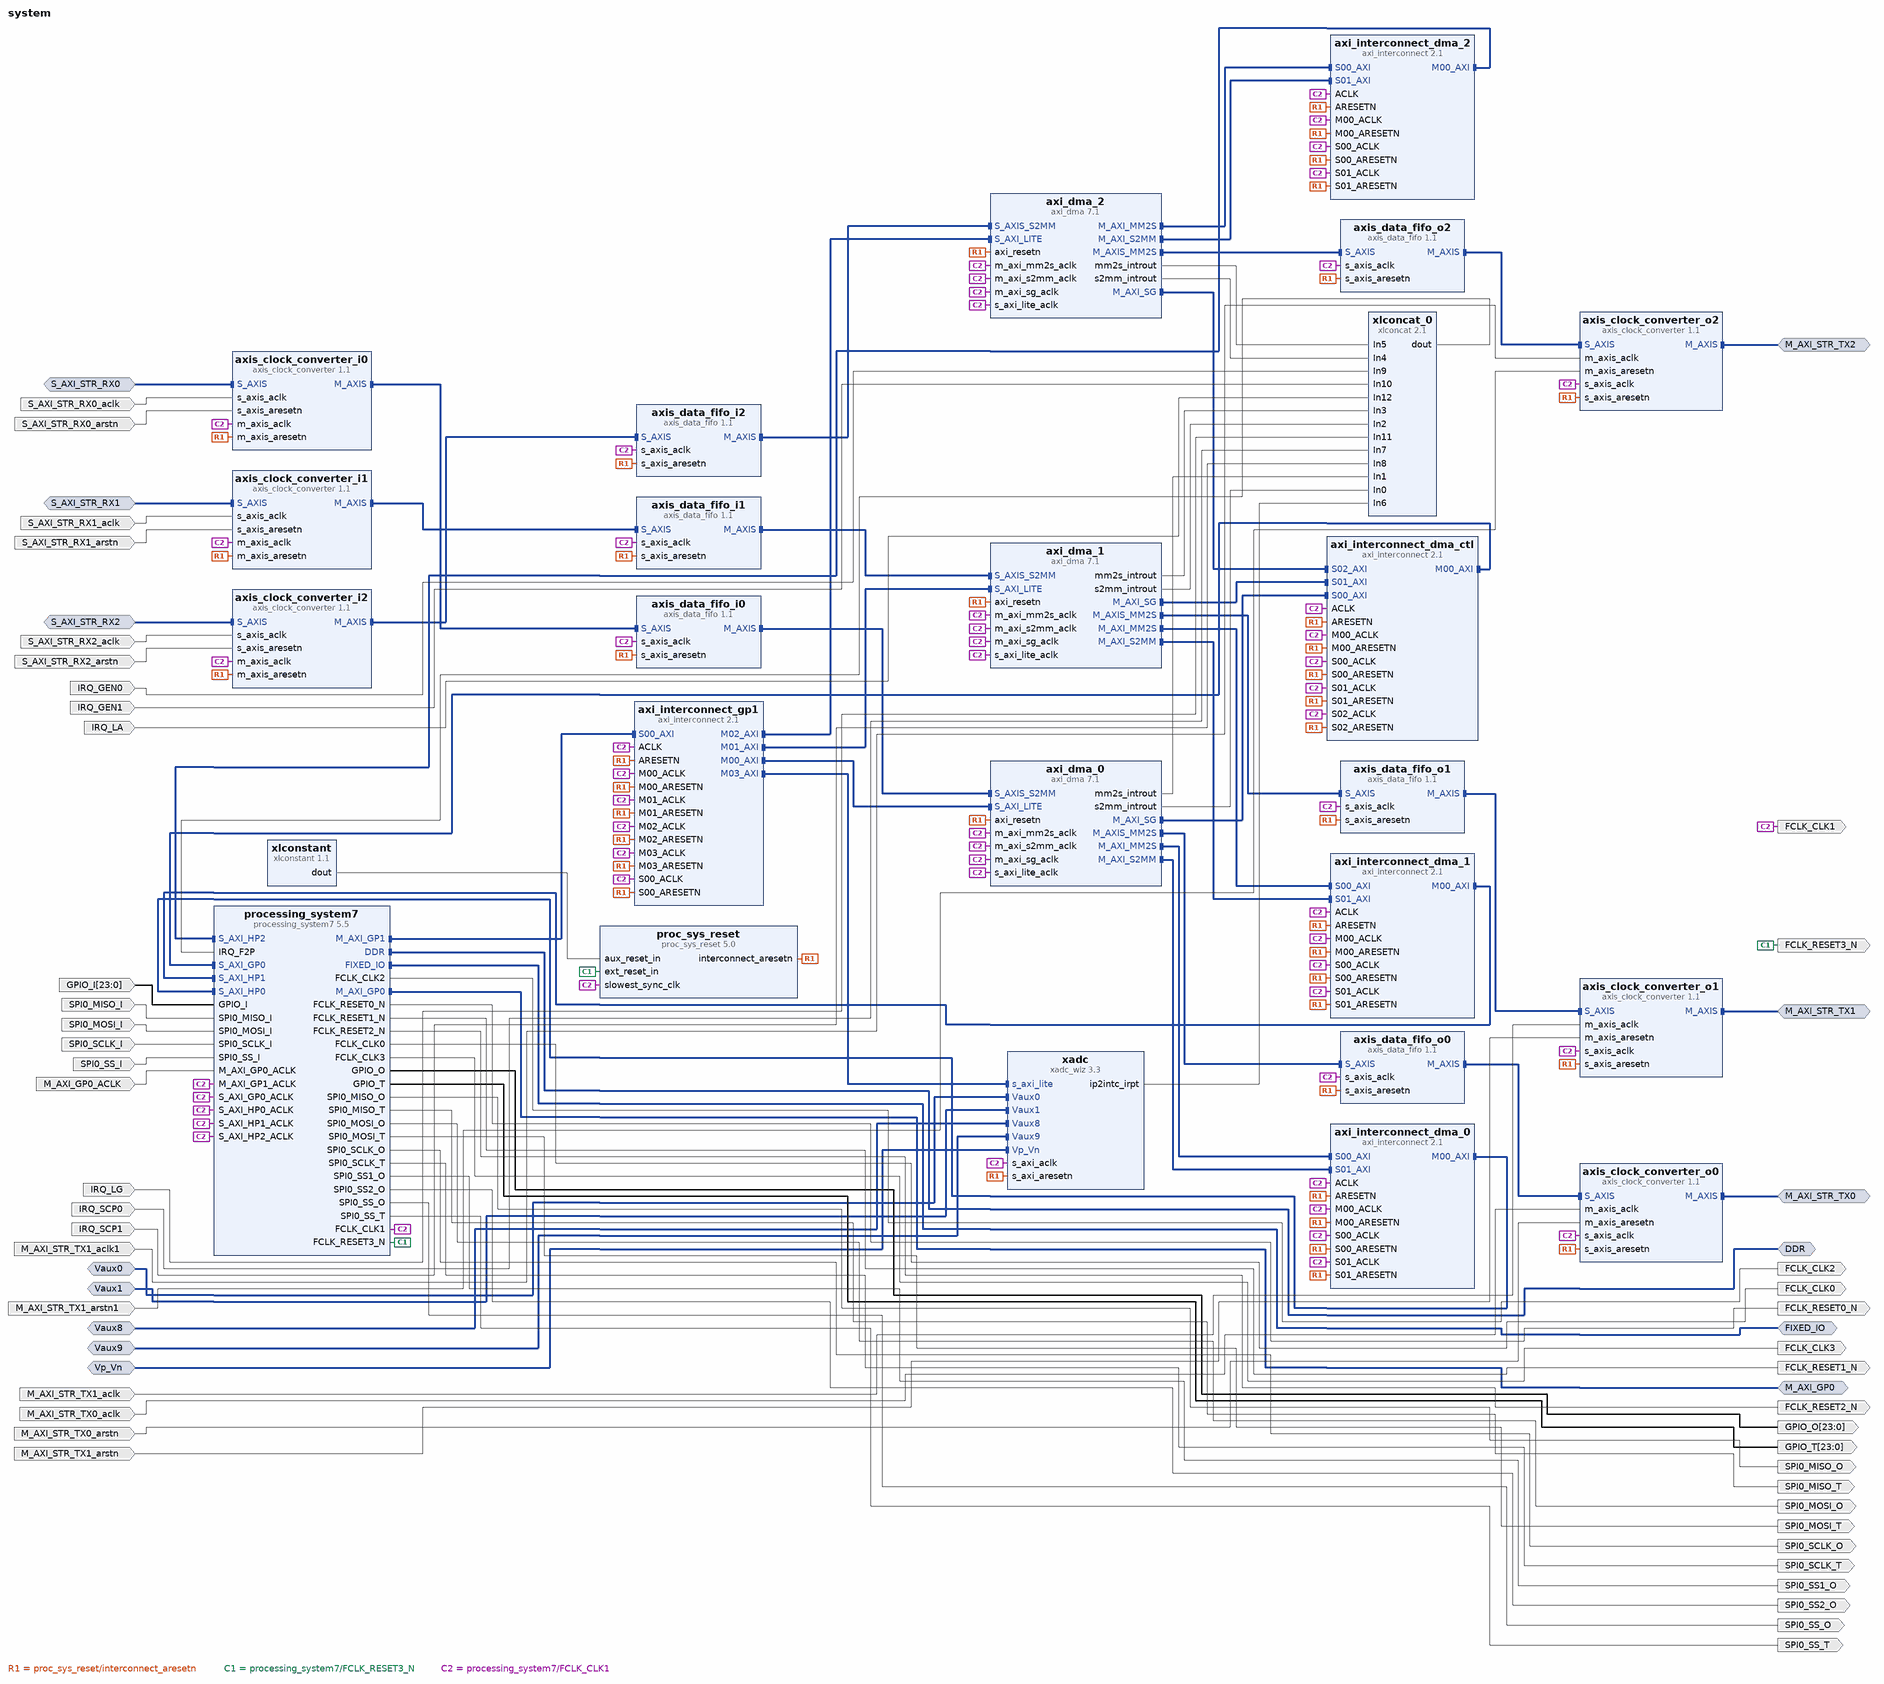
[diagram p0: block diagram of the top level]
# Vivado block design system, xc7z010clg400-1, Vivado 2016.4
create_bd_design system

create_bd_intf_port -mode Master -vlnv xilinx.com:interface:ddrx_rtl:1.0 DDR
create_bd_intf_port -mode Master -vlnv xilinx.com:display_processing_system7:fixedio_rtl:1.0 FIXED_IO
create_bd_intf_port -mode Master -vlnv xilinx.com:interface:aximm_rtl:1.0 M_AXI_GP0
set_property -dict [list \
  CONFIG.DATA_WIDTH 32 \
  CONFIG.PROTOCOL AXI3 \
  CONFIG.FREQ_HZ 125000000 \
  CONFIG.ADDR_WIDTH 32 \
] [get_bd_intf_ports M_AXI_GP0]
create_bd_intf_port -mode Master -vlnv xilinx.com:interface:axis_rtl:1.0 M_AXI_STR_TX0
set_property -dict {CONFIG.FREQ_HZ 125000000} [get_bd_intf_ports M_AXI_STR_TX0]
create_bd_intf_port -mode Master -vlnv xilinx.com:interface:axis_rtl:1.0 M_AXI_STR_TX1
set_property -dict {CONFIG.FREQ_HZ 125000000} [get_bd_intf_ports M_AXI_STR_TX1]
create_bd_intf_port -mode Master -vlnv xilinx.com:interface:axis_rtl:1.0 M_AXI_STR_TX2
set_property -dict {CONFIG.FREQ_HZ 125000000} [get_bd_intf_ports M_AXI_STR_TX2]
create_bd_intf_port -mode Slave -vlnv xilinx.com:interface:axis_rtl:1.0 S_AXI_STR_RX0
set_property -dict [list \
  CONFIG.TDATA_NUM_BYTES 2 \
  CONFIG.TDEST_WIDTH 0 \
  CONFIG.TID_WIDTH 0 \
  CONFIG.TUSER_WIDTH 0 \
  CONFIG.HAS_TREADY 1 \
  CONFIG.HAS_TSTRB 0 \
  CONFIG.HAS_TKEEP 1 \
  CONFIG.HAS_TLAST 1 \
  CONFIG.FREQ_HZ 125000000 \
  CONFIG.LAYERED_METADATA undef \
] [get_bd_intf_ports S_AXI_STR_RX0]
create_bd_intf_port -mode Slave -vlnv xilinx.com:interface:axis_rtl:1.0 S_AXI_STR_RX1
set_property -dict [list \
  CONFIG.TDATA_NUM_BYTES 2 \
  CONFIG.TDEST_WIDTH 0 \
  CONFIG.TID_WIDTH 0 \
  CONFIG.TUSER_WIDTH 0 \
  CONFIG.HAS_TREADY 1 \
  CONFIG.HAS_TSTRB 0 \
  CONFIG.HAS_TKEEP 1 \
  CONFIG.HAS_TLAST 1 \
  CONFIG.FREQ_HZ 125000000 \
  CONFIG.LAYERED_METADATA undef \
] [get_bd_intf_ports S_AXI_STR_RX1]
create_bd_intf_port -mode Slave -vlnv xilinx.com:interface:axis_rtl:1.0 S_AXI_STR_RX2
set_property -dict [list \
  CONFIG.TDATA_NUM_BYTES 2 \
  CONFIG.TDEST_WIDTH 0 \
  CONFIG.TID_WIDTH 0 \
  CONFIG.TUSER_WIDTH 0 \
  CONFIG.HAS_TREADY 1 \
  CONFIG.HAS_TSTRB 0 \
  CONFIG.HAS_TKEEP 1 \
  CONFIG.HAS_TLAST 1 \
  CONFIG.FREQ_HZ 125000000 \
  CONFIG.LAYERED_METADATA undef \
] [get_bd_intf_ports S_AXI_STR_RX2]
create_bd_intf_port -mode Slave -vlnv xilinx.com:interface:diff_analog_io_rtl:1.0 Vaux0
create_bd_intf_port -mode Slave -vlnv xilinx.com:interface:diff_analog_io_rtl:1.0 Vaux1
create_bd_intf_port -mode Slave -vlnv xilinx.com:interface:diff_analog_io_rtl:1.0 Vaux8
create_bd_intf_port -mode Slave -vlnv xilinx.com:interface:diff_analog_io_rtl:1.0 Vaux9
create_bd_intf_port -mode Slave -vlnv xilinx.com:interface:diff_analog_io_rtl:1.0 Vp_Vn
create_bd_port -dir O -type clk FCLK_CLK0
create_bd_port -dir O -type clk FCLK_CLK1
set_property -dict {CONFIG.ASSOCIATED_BUSIF M_AXI_STR_TX3:S_AXI_STR_RX3} [get_bd_ports FCLK_CLK1]
create_bd_port -dir O -type clk FCLK_CLK2
create_bd_port -dir O -type clk FCLK_CLK3
create_bd_port -dir O -type rst FCLK_RESET0_N
create_bd_port -dir O -type rst FCLK_RESET1_N
create_bd_port -dir O -type rst FCLK_RESET2_N
create_bd_port -dir O -type rst FCLK_RESET3_N
create_bd_port -dir I -from 23 -to 0 -type data GPIO_I
create_bd_port -dir O -from 23 -to 0 -type data GPIO_O
create_bd_port -dir O -from 23 -to 0 -type data GPIO_T
create_bd_port -dir I -type intr IRQ_GEN0
set_property -dict {CONFIG.SENSITIVITY EDGE_RISING} [get_bd_ports IRQ_GEN0]
create_bd_port -dir I -type intr IRQ_GEN1
set_property -dict {CONFIG.SENSITIVITY EDGE_RISING} [get_bd_ports IRQ_GEN1]
create_bd_port -dir I -type intr IRQ_LA
set_property -dict {CONFIG.SENSITIVITY EDGE_RISING} [get_bd_ports IRQ_LA]
create_bd_port -dir I -type intr IRQ_LG
set_property -dict {CONFIG.SENSITIVITY EDGE_RISING} [get_bd_ports IRQ_LG]
create_bd_port -dir I -type intr IRQ_SCP0
set_property -dict {CONFIG.SENSITIVITY EDGE_RISING} [get_bd_ports IRQ_SCP0]
create_bd_port -dir I -type intr IRQ_SCP1
set_property -dict {CONFIG.SENSITIVITY EDGE_RISING} [get_bd_ports IRQ_SCP1]
create_bd_port -dir I -type clk M_AXI_GP0_ACLK
set_property -dict {CONFIG.FREQ_HZ 125000000 CONFIG.ASSOCIATED_BUSIF M_AXI_GP0} [get_bd_ports M_AXI_GP0_ACLK]
create_bd_port -dir I -type clk M_AXI_STR_TX0_aclk
set_property -dict [list \
  CONFIG.FREQ_HZ 125000000 \
  CONFIG.ASSOCIATED_BUSIF M_AXI_STR_TX0 \
  CONFIG.ASSOCIATED_RESET M_AXI_STR_TX0_arstn \
] [get_bd_ports M_AXI_STR_TX0_aclk]
create_bd_port -dir I -type rst M_AXI_STR_TX0_arstn
create_bd_port -dir I -type clk M_AXI_STR_TX1_aclk
set_property -dict [list \
  CONFIG.FREQ_HZ 125000000 \
  CONFIG.ASSOCIATED_BUSIF M_AXI_STR_TX1 \
  CONFIG.ASSOCIATED_RESET M_AXI_STR_TX1_arstn \
] [get_bd_ports M_AXI_STR_TX1_aclk]
create_bd_port -dir I -type clk M_AXI_STR_TX1_aclk1
set_property -dict [list \
  CONFIG.FREQ_HZ 125000000 \
  CONFIG.ASSOCIATED_BUSIF M_AXI_STR_TX1:M_AXI_STR_TX2 \
  CONFIG.ASSOCIATED_RESET M_AXI_STR_TX1_arstn:M_AXI_STR_TX1_arstn1 \
] [get_bd_ports M_AXI_STR_TX1_aclk1]
create_bd_port -dir I -type rst M_AXI_STR_TX1_arstn
create_bd_port -dir I -type rst M_AXI_STR_TX1_arstn1
create_bd_port -dir I SPI0_MISO_I
create_bd_port -dir O SPI0_MISO_O
create_bd_port -dir O SPI0_MISO_T
create_bd_port -dir I SPI0_MOSI_I
create_bd_port -dir O SPI0_MOSI_O
create_bd_port -dir O SPI0_MOSI_T
create_bd_port -dir I SPI0_SCLK_I
create_bd_port -dir O SPI0_SCLK_O
create_bd_port -dir O SPI0_SCLK_T
create_bd_port -dir O SPI0_SS1_O
create_bd_port -dir O SPI0_SS2_O
create_bd_port -dir I SPI0_SS_I
create_bd_port -dir O SPI0_SS_O
create_bd_port -dir O SPI0_SS_T
create_bd_port -dir I -type clk S_AXI_STR_RX0_aclk
set_property -dict [list \
  CONFIG.FREQ_HZ 125000000 \
  CONFIG.ASSOCIATED_BUSIF S_AXI_STR_RX0 \
  CONFIG.ASSOCIATED_RESET S_AXI_STR_RX0_arstn \
] [get_bd_ports S_AXI_STR_RX0_aclk]
create_bd_port -dir I -type rst S_AXI_STR_RX0_arstn
create_bd_port -dir I -type clk S_AXI_STR_RX1_aclk
set_property -dict [list \
  CONFIG.FREQ_HZ 125000000 \
  CONFIG.ASSOCIATED_BUSIF S_AXI_STR_RX1 \
  CONFIG.ASSOCIATED_RESET S_AXI_STR_RX1_arstn \
] [get_bd_ports S_AXI_STR_RX1_aclk]
create_bd_port -dir I -type rst S_AXI_STR_RX1_arstn
create_bd_port -dir I -type clk S_AXI_STR_RX2_aclk
set_property -dict [list \
  CONFIG.FREQ_HZ 125000000 \
  CONFIG.ASSOCIATED_BUSIF S_AXI_STR_RX1:S_AXI_STR_RX2 \
  CONFIG.ASSOCIATED_RESET S_AXI_STR_RX1_arstn:S_AXI_STR_RX2_arstn \
] [get_bd_ports S_AXI_STR_RX2_aclk]
create_bd_port -dir I -type rst S_AXI_STR_RX2_arstn

create_bd_cell -type ip -vlnv xilinx.com:ip:axi_dma:7.1 axi_dma_0
set_property -dict [list \
  CONFIG.c_include_sg 1 \
  CONFIG.c_sg_length_width 14 \
  CONFIG.c_sg_include_stscntrl_strm 0 \
  CONFIG.c_micro_dma 0 \
  CONFIG.c_include_mm2s 1 \
  CONFIG.c_m_axi_mm2s_data_width 32 \
  CONFIG.c_m_axis_mm2s_tdata_width 16 \
  CONFIG.c_mm2s_burst_size 16 \
  CONFIG.c_s2mm_burst_size 64 \
] [get_bd_cells axi_dma_0]
create_bd_cell -type ip -vlnv xilinx.com:ip:axi_dma:7.1 axi_dma_1
set_property -dict [list \
  CONFIG.c_include_sg 1 \
  CONFIG.c_sg_length_width 23 \
  CONFIG.c_sg_include_stscntrl_strm 0 \
  CONFIG.c_include_mm2s 1 \
  CONFIG.c_m_axi_mm2s_data_width 32 \
  CONFIG.c_m_axis_mm2s_tdata_width 16 \
  CONFIG.c_mm2s_burst_size 64 \
  CONFIG.c_s2mm_burst_size 64 \
] [get_bd_cells axi_dma_1]
create_bd_cell -type ip -vlnv xilinx.com:ip:axi_dma:7.1 axi_dma_2
set_property -dict [list \
  CONFIG.c_include_sg 1 \
  CONFIG.c_sg_length_width 23 \
  CONFIG.c_sg_include_stscntrl_strm 0 \
  CONFIG.c_include_mm2s 1 \
  CONFIG.c_m_axi_mm2s_data_width 32 \
  CONFIG.c_m_axis_mm2s_tdata_width 16 \
  CONFIG.c_mm2s_burst_size 64 \
  CONFIG.c_s2mm_burst_size 64 \
] [get_bd_cells axi_dma_2]
create_bd_cell -type ip -vlnv xilinx.com:ip:axi_interconnect:2.1 axi_interconnect_dma_0
set_property -dict {CONFIG.NUM_SI 2 CONFIG.NUM_MI 1 CONFIG.STRATEGY 1} [get_bd_cells axi_interconnect_dma_0]
create_bd_cell -type ip -vlnv xilinx.com:ip:axi_interconnect:2.1 axi_interconnect_dma_1
set_property -dict {CONFIG.NUM_SI 2 CONFIG.NUM_MI 1 CONFIG.STRATEGY 1} [get_bd_cells axi_interconnect_dma_1]
create_bd_cell -type ip -vlnv xilinx.com:ip:axi_interconnect:2.1 axi_interconnect_dma_2
set_property -dict {CONFIG.NUM_SI 2 CONFIG.NUM_MI 1 CONFIG.STRATEGY 1} [get_bd_cells axi_interconnect_dma_2]
create_bd_cell -type ip -vlnv xilinx.com:ip:axi_interconnect:2.1 axi_interconnect_dma_ctl
set_property -dict {CONFIG.NUM_SI 3 CONFIG.NUM_MI 1 CONFIG.STRATEGY 1} [get_bd_cells axi_interconnect_dma_ctl]
create_bd_cell -type ip -vlnv xilinx.com:ip:axi_interconnect:2.1 axi_interconnect_gp1
set_property -dict {CONFIG.NUM_SI 1 CONFIG.NUM_MI 4 CONFIG.STRATEGY 1} [get_bd_cells axi_interconnect_gp1]
create_bd_cell -type ip -vlnv xilinx.com:ip:axis_clock_converter:1.1 axis_clock_converter_i0
create_bd_cell -type ip -vlnv xilinx.com:ip:axis_clock_converter:1.1 axis_clock_converter_i1
create_bd_cell -type ip -vlnv xilinx.com:ip:axis_clock_converter:1.1 axis_clock_converter_i2
create_bd_cell -type ip -vlnv xilinx.com:ip:axis_clock_converter:1.1 axis_clock_converter_o0
create_bd_cell -type ip -vlnv xilinx.com:ip:axis_clock_converter:1.1 axis_clock_converter_o1
create_bd_cell -type ip -vlnv xilinx.com:ip:axis_clock_converter:1.1 axis_clock_converter_o2
create_bd_cell -type ip -vlnv xilinx.com:ip:axis_data_fifo:1.1 axis_data_fifo_i0
set_property -dict {CONFIG.FIFO_DEPTH 2048 CONFIG.FIFO_MODE 2} [get_bd_cells axis_data_fifo_i0]
create_bd_cell -type ip -vlnv xilinx.com:ip:axis_data_fifo:1.1 axis_data_fifo_i1
set_property -dict {CONFIG.FIFO_DEPTH 2048 CONFIG.FIFO_MODE 2} [get_bd_cells axis_data_fifo_i1]
create_bd_cell -type ip -vlnv xilinx.com:ip:axis_data_fifo:1.1 axis_data_fifo_i2
set_property -dict {CONFIG.FIFO_DEPTH 2048 CONFIG.FIFO_MODE 2} [get_bd_cells axis_data_fifo_i2]
create_bd_cell -type ip -vlnv xilinx.com:ip:axis_data_fifo:1.1 axis_data_fifo_o0
set_property -dict {CONFIG.FIFO_DEPTH 2048 CONFIG.FIFO_MODE 2} [get_bd_cells axis_data_fifo_o0]
create_bd_cell -type ip -vlnv xilinx.com:ip:axis_data_fifo:1.1 axis_data_fifo_o1
set_property -dict {CONFIG.FIFO_DEPTH 2048 CONFIG.FIFO_MODE 2} [get_bd_cells axis_data_fifo_o1]
create_bd_cell -type ip -vlnv xilinx.com:ip:axis_data_fifo:1.1 axis_data_fifo_o2
set_property -dict {CONFIG.FIFO_DEPTH 2048 CONFIG.FIFO_MODE 2} [get_bd_cells axis_data_fifo_o2]
create_bd_cell -type ip -vlnv xilinx.com:ip:proc_sys_reset:5.0 proc_sys_reset
set_property -dict {CONFIG.C_EXT_RST_WIDTH 1} [get_bd_cells proc_sys_reset]
create_bd_cell -type ip -vlnv xilinx.com:ip:processing_system7:5.5 processing_system7
set_property -dict [list \
  CONFIG.PCW_QSPI_PERIPHERAL_FREQMHZ 125 \
  CONFIG.PCW_FPGA0_PERIPHERAL_FREQMHZ 125 \
  CONFIG.PCW_FPGA1_PERIPHERAL_FREQMHZ 142 \
  CONFIG.PCW_FPGA2_PERIPHERAL_FREQMHZ 166 \
  CONFIG.PCW_FPGA3_PERIPHERAL_FREQMHZ 200 \
  CONFIG.PCW_USE_M_AXI_GP1 1 \
  CONFIG.PCW_USE_S_AXI_GP0 1 \
  CONFIG.PCW_USE_S_AXI_HP0 1 \
  CONFIG.PCW_USE_S_AXI_HP1 1 \
  CONFIG.PCW_USE_S_AXI_HP2 1 \
  CONFIG.PCW_USE_FABRIC_INTERRUPT 1 \
  CONFIG.PCW_S_AXI_HP0_DATA_WIDTH 32 \
  CONFIG.PCW_S_AXI_HP1_DATA_WIDTH 32 \
  CONFIG.PCW_S_AXI_HP2_DATA_WIDTH 32 \
  CONFIG.PCW_EN_CLK1_PORT 1 \
  CONFIG.PCW_EN_CLK2_PORT 1 \
  CONFIG.PCW_EN_CLK3_PORT 1 \
  CONFIG.PCW_EN_RST1_PORT 1 \
  CONFIG.PCW_EN_RST2_PORT 1 \
  CONFIG.PCW_EN_RST3_PORT 1 \
  CONFIG.PCW_IRQ_F2P_INTR 1 \
  CONFIG.PCW_PRESET_BANK1_VOLTAGE {LVCMOS 2.5V} \
  CONFIG.PCW_UIPARAM_DDR_BUS_WIDTH {16 Bit} \
  CONFIG.PCW_UIPARAM_DDR_PARTNO {MT41J256M16 RE-125} \
  CONFIG.PCW_QSPI_PERIPHERAL_ENABLE 1 \
  CONFIG.PCW_QSPI_GRP_SINGLE_SS_ENABLE 1 \
  CONFIG.PCW_ENET0_PERIPHERAL_ENABLE 1 \
  CONFIG.PCW_ENET0_ENET0_IO {MIO 16 .. 27} \
  CONFIG.PCW_ENET0_GRP_MDIO_ENABLE 1 \
  CONFIG.PCW_ENET0_RESET_ENABLE 0 \
  CONFIG.PCW_SD0_PERIPHERAL_ENABLE 1 \
  CONFIG.PCW_SD0_GRP_CD_ENABLE 1 \
  CONFIG.PCW_SD0_GRP_CD_IO {MIO 46} \
  CONFIG.PCW_SD0_GRP_WP_ENABLE 1 \
  CONFIG.PCW_SD0_GRP_WP_IO {MIO 47} \
  CONFIG.PCW_UART0_PERIPHERAL_ENABLE 1 \
  CONFIG.PCW_UART0_UART0_IO {MIO 14 .. 15} \
  CONFIG.PCW_UART1_PERIPHERAL_ENABLE 1 \
  CONFIG.PCW_UART1_UART1_IO {MIO 8 .. 9} \
  CONFIG.PCW_SPI0_PERIPHERAL_ENABLE 1 \
  CONFIG.PCW_SPI1_PERIPHERAL_ENABLE 1 \
  CONFIG.PCW_SPI1_SPI1_IO {MIO 10 .. 15} \
  CONFIG.PCW_TTC0_PERIPHERAL_ENABLE 1 \
  CONFIG.PCW_USB0_PERIPHERAL_ENABLE 1 \
  CONFIG.PCW_USB0_RESET_ENABLE 1 \
  CONFIG.PCW_USB0_RESET_IO {MIO 48} \
  CONFIG.PCW_I2C0_PERIPHERAL_ENABLE 1 \
  CONFIG.PCW_I2C0_I2C0_IO {MIO 50 .. 51} \
  CONFIG.PCW_GPIO_MIO_GPIO_ENABLE 1 \
  CONFIG.PCW_GPIO_EMIO_GPIO_ENABLE 1 \
  CONFIG.PCW_GPIO_EMIO_GPIO_IO 24 \
] [get_bd_cells processing_system7]
# 57 more settings of processing_system7 are not shown: defaults, MIO pin electricals, DDR timing, and values the tool derives
create_bd_cell -type ip -vlnv xilinx.com:ip:xadc_wiz:3.3 xadc
set_property -dict [list \
  CONFIG.XADC_STARUP_SELECTION independent_adc \
  CONFIG.SEQUENCER_MODE Off \
  CONFIG.SINGLE_CHANNEL_SELECTION TEMPERATURE \
  CONFIG.EXTERNAL_MUX_CHANNEL VP_VN \
  CONFIG.CHANNEL_ENABLE_VP_VN true \
  CONFIG.CHANNEL_ENABLE_VAUXP0_VAUXN0 true \
  CONFIG.CHANNEL_ENABLE_VAUXP1_VAUXN1 true \
  CONFIG.CHANNEL_ENABLE_VAUXP8_VAUXN8 true \
  CONFIG.CHANNEL_ENABLE_VAUXP9_VAUXN9 true \
] [get_bd_cells xadc]
create_bd_cell -type ip -vlnv xilinx.com:ip:xlconcat:2.1 xlconcat_0
set_property -dict {CONFIG.NUM_PORTS 13} [get_bd_cells xlconcat_0]
create_bd_cell -type ip -vlnv xilinx.com:ip:xlconstant:1.1 xlconstant

# ---- connections ----

connect_bd_intf_net [get_bd_intf_pins axi_dma_1/M_AXI_SG] [get_bd_intf_pins axi_interconnect_dma_ctl/S01_AXI]
connect_bd_intf_net [get_bd_intf_pins axi_dma_2/M_AXI_SG] [get_bd_intf_pins axi_interconnect_dma_ctl/S02_AXI]
connect_bd_intf_net [get_bd_intf_pins axi_dma_0/M_AXIS_MM2S] [get_bd_intf_pins axis_data_fifo_o0/S_AXIS]
connect_bd_intf_net [get_bd_intf_pins axi_dma_0/M_AXI_MM2S] [get_bd_intf_pins axi_interconnect_dma_0/S00_AXI]
connect_bd_intf_net [get_bd_intf_pins axi_dma_0/M_AXI_S2MM] [get_bd_intf_pins axi_interconnect_dma_0/S01_AXI]
connect_bd_intf_net [get_bd_intf_pins axi_dma_0/M_AXI_SG] [get_bd_intf_pins axi_interconnect_dma_ctl/S00_AXI]
connect_bd_intf_net -intf_net axi_dma_2_M_AXIS_MM2S [get_bd_intf_pins axi_dma_1/M_AXIS_MM2S] [get_bd_intf_pins axis_data_fifo_o1/S_AXIS]
connect_bd_intf_net [get_bd_intf_pins axi_dma_2/M_AXIS_MM2S] [get_bd_intf_pins axis_data_fifo_o2/S_AXIS]
connect_bd_intf_net -intf_net axi_dma_2_M_AXI_MM2S [get_bd_intf_pins axi_dma_1/M_AXI_MM2S] [get_bd_intf_pins axi_interconnect_dma_1/S00_AXI]
connect_bd_intf_net [get_bd_intf_pins axi_dma_2/M_AXI_MM2S] [get_bd_intf_pins axi_interconnect_dma_2/S00_AXI]
connect_bd_intf_net -intf_net axi_dma_2_M_AXI_S2MM [get_bd_intf_pins axi_dma_1/M_AXI_S2MM] [get_bd_intf_pins axi_interconnect_dma_1/S01_AXI]
connect_bd_intf_net [get_bd_intf_pins axi_dma_2/M_AXI_S2MM] [get_bd_intf_pins axi_interconnect_dma_2/S01_AXI]
connect_bd_intf_net -intf_net axi_interconnect_0_M00_AXI [get_bd_intf_pins axi_dma_0/S_AXI_LITE] [get_bd_intf_pins axi_interconnect_gp1/M00_AXI]
connect_bd_intf_net -intf_net axi_interconnect_1_M00_AXI [get_bd_intf_pins axi_interconnect_dma_0/M00_AXI] [get_bd_intf_pins processing_system7/S_AXI_HP0]
connect_bd_intf_net -intf_net axi_interconnect_2_M00_AXI [get_bd_intf_pins axi_interconnect_dma_1/M00_AXI] [get_bd_intf_pins processing_system7/S_AXI_HP1]
connect_bd_intf_net -intf_net axi_interconnect_5_M00_AXI [get_bd_intf_pins axi_interconnect_dma_ctl/M00_AXI] [get_bd_intf_pins processing_system7/S_AXI_GP0]
connect_bd_intf_net -intf_net axi_interconnect_8_M01_AXI [get_bd_intf_pins axi_dma_1/S_AXI_LITE] [get_bd_intf_pins axi_interconnect_gp1/M01_AXI]
connect_bd_intf_net [get_bd_intf_pins axi_interconnect_dma_2/M00_AXI] [get_bd_intf_pins processing_system7/S_AXI_HP2]
connect_bd_intf_net [get_bd_intf_pins axi_dma_2/S_AXI_LITE] [get_bd_intf_pins axi_interconnect_gp1/M02_AXI]
connect_bd_intf_net [get_bd_intf_pins axi_interconnect_gp1/M03_AXI] [get_bd_intf_pins xadc/s_axi_lite]
connect_bd_intf_net -intf_net axis_clock_converter_2_M_AXIS [get_bd_intf_pins axis_clock_converter_i1/M_AXIS] [get_bd_intf_pins axis_data_fifo_i1/S_AXIS]
connect_bd_intf_net -intf_net axis_clock_converter_3_M_AXIS [get_bd_intf_pins axis_clock_converter_i0/M_AXIS] [get_bd_intf_pins axis_data_fifo_i0/S_AXIS]
connect_bd_intf_net [get_bd_intf_pins axis_clock_converter_i2/M_AXIS] [get_bd_intf_pins axis_data_fifo_i2/S_AXIS]
connect_bd_intf_net -intf_net axis_data_fifo_2_M_AXIS [get_bd_intf_pins axi_dma_1/S_AXIS_S2MM] [get_bd_intf_pins axis_data_fifo_i1/M_AXIS]
connect_bd_intf_net -intf_net axis_data_fifo_3_M_AXIS [get_bd_intf_pins axi_dma_0/S_AXIS_S2MM] [get_bd_intf_pins axis_data_fifo_i0/M_AXIS]
connect_bd_intf_net -intf_net axis_data_fifo_6_M_AXIS [get_bd_intf_pins axis_clock_converter_o1/S_AXIS] [get_bd_intf_pins axis_data_fifo_o1/M_AXIS]
connect_bd_intf_net -intf_net axis_data_fifo_7_M_AXIS [get_bd_intf_pins axis_clock_converter_o0/S_AXIS] [get_bd_intf_pins axis_data_fifo_o0/M_AXIS]
connect_bd_intf_net [get_bd_intf_pins axi_dma_2/S_AXIS_S2MM] [get_bd_intf_pins axis_data_fifo_i2/M_AXIS]
connect_bd_intf_net [get_bd_intf_pins axis_clock_converter_o2/S_AXIS] [get_bd_intf_pins axis_data_fifo_o2/M_AXIS]
connect_bd_intf_net [get_bd_intf_pins axi_interconnect_gp1/S00_AXI] [get_bd_intf_pins processing_system7/M_AXI_GP1]
connect_bd_intf_net -intf_net processing_system7_0_ddr [get_bd_intf_ports DDR] [get_bd_intf_pins processing_system7/DDR]
connect_bd_intf_net -intf_net processing_system7_0_fixed_io [get_bd_intf_ports FIXED_IO] [get_bd_intf_pins processing_system7/FIXED_IO]
connect_bd_intf_net -intf_net processing_system7_0_M_AXI_GP0 [get_bd_intf_ports M_AXI_GP0] [get_bd_intf_pins processing_system7/M_AXI_GP0]
connect_bd_intf_net -intf_net axis_clock_converter_7_M_AXIS [get_bd_intf_ports M_AXI_STR_TX0] [get_bd_intf_pins axis_clock_converter_o0/M_AXIS]
connect_bd_intf_net -intf_net axis_clock_converter_6_M_AXIS [get_bd_intf_ports M_AXI_STR_TX1] [get_bd_intf_pins axis_clock_converter_o1/M_AXIS]
connect_bd_intf_net [get_bd_intf_ports M_AXI_STR_TX2] [get_bd_intf_pins axis_clock_converter_o2/M_AXIS]
connect_bd_intf_net -intf_net S_AXI_STR_RX0_1 [get_bd_intf_ports S_AXI_STR_RX0] [get_bd_intf_pins axis_clock_converter_i0/S_AXIS]
connect_bd_intf_net -intf_net S_AXI_STR_RX2_1 [get_bd_intf_ports S_AXI_STR_RX1] [get_bd_intf_pins axis_clock_converter_i1/S_AXIS]
connect_bd_intf_net -intf_net S_AXI_STR_RX2_2 [get_bd_intf_ports S_AXI_STR_RX2] [get_bd_intf_pins axis_clock_converter_i2/S_AXIS]
connect_bd_intf_net -intf_net Vaux0_1 [get_bd_intf_ports Vaux0] [get_bd_intf_pins xadc/Vaux0]
connect_bd_intf_net -intf_net Vaux1_1 [get_bd_intf_ports Vaux1] [get_bd_intf_pins xadc/Vaux1]
connect_bd_intf_net -intf_net Vaux8_1 [get_bd_intf_ports Vaux8] [get_bd_intf_pins xadc/Vaux8]
connect_bd_intf_net -intf_net Vaux9_1 [get_bd_intf_ports Vaux9] [get_bd_intf_pins xadc/Vaux9]
connect_bd_intf_net [get_bd_intf_ports Vp_Vn] [get_bd_intf_pins xadc/Vp_Vn]
connect_bd_net [get_bd_ports GPIO_I] [get_bd_pins processing_system7/GPIO_I]
connect_bd_net -net IRQ_GEN0_1 [get_bd_ports IRQ_GEN0] [get_bd_pins xlconcat_0/In9]
connect_bd_net -net IRQ_GEN1_1 [get_bd_ports IRQ_GEN1] [get_bd_pins xlconcat_0/In10]
connect_bd_net [get_bd_ports IRQ_LA] [get_bd_pins xlconcat_0/In12]
connect_bd_net [get_bd_ports IRQ_LG] [get_bd_pins xlconcat_0/In11]
connect_bd_net -net IRQ_SCP0_1 [get_bd_ports IRQ_SCP0] [get_bd_pins xlconcat_0/In7]
connect_bd_net -net IRQ_SCP1_1 [get_bd_ports IRQ_SCP1] [get_bd_pins xlconcat_0/In8]
connect_bd_net [get_bd_ports M_AXI_STR_TX0_aclk] [get_bd_pins axis_clock_converter_o0/m_axis_aclk]
connect_bd_net [get_bd_ports M_AXI_STR_TX0_arstn] [get_bd_pins axis_clock_converter_o0/m_axis_aresetn]
connect_bd_net -net M_AXI_STR_TX1_aclk1_1 [get_bd_ports M_AXI_STR_TX1_aclk1] [get_bd_pins axis_clock_converter_o2/m_axis_aclk]
connect_bd_net [get_bd_ports M_AXI_STR_TX1_aclk] [get_bd_pins axis_clock_converter_o1/m_axis_aclk]
connect_bd_net -net M_AXI_STR_TX1_arstn1_1 [get_bd_ports M_AXI_STR_TX1_arstn1] [get_bd_pins axis_clock_converter_o2/m_axis_aresetn]
connect_bd_net [get_bd_ports M_AXI_STR_TX1_arstn] [get_bd_pins axis_clock_converter_o1/m_axis_aresetn]
connect_bd_net [get_bd_ports SPI0_MISO_I] [get_bd_pins processing_system7/SPI0_MISO_I]
connect_bd_net [get_bd_ports SPI0_MOSI_I] [get_bd_pins processing_system7/SPI0_MOSI_I]
connect_bd_net [get_bd_ports SPI0_SCLK_I] [get_bd_pins processing_system7/SPI0_SCLK_I]
connect_bd_net [get_bd_ports SPI0_SS_I] [get_bd_pins processing_system7/SPI0_SS_I]
connect_bd_net [get_bd_ports S_AXI_STR_RX0_aclk] [get_bd_pins axis_clock_converter_i0/s_axis_aclk]
connect_bd_net [get_bd_ports S_AXI_STR_RX0_arstn] [get_bd_pins axis_clock_converter_i0/s_axis_aresetn]
connect_bd_net -net S_AXI_STR_RX1_aclk1_1 [get_bd_ports S_AXI_STR_RX2_aclk] [get_bd_pins axis_clock_converter_i2/s_axis_aclk]
connect_bd_net [get_bd_ports S_AXI_STR_RX1_aclk] [get_bd_pins axis_clock_converter_i1/s_axis_aclk]
connect_bd_net -net S_AXI_STR_RX1_arstn1_1 [get_bd_ports S_AXI_STR_RX2_arstn] [get_bd_pins axis_clock_converter_i2/s_axis_aresetn]
connect_bd_net [get_bd_ports S_AXI_STR_RX1_arstn] [get_bd_pins axis_clock_converter_i1/s_axis_aresetn]
connect_bd_net [get_bd_pins axi_dma_0/mm2s_introut] [get_bd_pins xlconcat_0/In1]
connect_bd_net [get_bd_pins axi_dma_0/s2mm_introut] [get_bd_pins xlconcat_0/In0]
connect_bd_net -net axi_dma_2_mm2s_introut [get_bd_pins axi_dma_1/mm2s_introut] [get_bd_pins xlconcat_0/In3]
connect_bd_net [get_bd_pins axi_dma_2/mm2s_introut] [get_bd_pins xlconcat_0/In5]
connect_bd_net -net axi_dma_2_s2mm_introut [get_bd_pins axi_dma_1/s2mm_introut] [get_bd_pins xlconcat_0/In2]
connect_bd_net [get_bd_pins axi_dma_2/s2mm_introut] [get_bd_pins xlconcat_0/In4]
connect_bd_net [get_bd_ports M_AXI_GP0_ACLK] [get_bd_pins processing_system7/M_AXI_GP0_ACLK]
connect_bd_net [get_bd_pins proc_sys_reset/interconnect_aresetn] \
  [get_bd_pins axi_dma_0/axi_resetn] [get_bd_pins axi_dma_1/axi_resetn] [get_bd_pins axi_dma_2/axi_resetn] \
  [get_bd_pins axi_interconnect_dma_0/ARESETN] [get_bd_pins axi_interconnect_dma_0/M00_ARESETN] \
  [get_bd_pins axi_interconnect_dma_0/S00_ARESETN] [get_bd_pins axi_interconnect_dma_0/S01_ARESETN] \
  [get_bd_pins axi_interconnect_dma_1/ARESETN] [get_bd_pins axi_interconnect_dma_1/M00_ARESETN] \
  [get_bd_pins axi_interconnect_dma_1/S00_ARESETN] [get_bd_pins axi_interconnect_dma_1/S01_ARESETN] \
  [get_bd_pins axi_interconnect_dma_2/ARESETN] [get_bd_pins axi_interconnect_dma_2/M00_ARESETN] \
  [get_bd_pins axi_interconnect_dma_2/S00_ARESETN] [get_bd_pins axi_interconnect_dma_2/S01_ARESETN] \
  [get_bd_pins axi_interconnect_dma_ctl/ARESETN] [get_bd_pins axi_interconnect_dma_ctl/M00_ARESETN] \
  [get_bd_pins axi_interconnect_dma_ctl/S00_ARESETN] [get_bd_pins axi_interconnect_dma_ctl/S01_ARESETN] \
  [get_bd_pins axi_interconnect_dma_ctl/S02_ARESETN] [get_bd_pins axi_interconnect_gp1/ARESETN] \
  [get_bd_pins axi_interconnect_gp1/M00_ARESETN] [get_bd_pins axi_interconnect_gp1/M01_ARESETN] \
  [get_bd_pins axi_interconnect_gp1/M02_ARESETN] [get_bd_pins axi_interconnect_gp1/M03_ARESETN] \
  [get_bd_pins axi_interconnect_gp1/S00_ARESETN] [get_bd_pins axis_clock_converter_i0/m_axis_aresetn] \
  [get_bd_pins axis_clock_converter_i1/m_axis_aresetn] [get_bd_pins axis_clock_converter_i2/m_axis_aresetn] \
  [get_bd_pins axis_clock_converter_o0/s_axis_aresetn] [get_bd_pins axis_clock_converter_o1/s_axis_aresetn] \
  [get_bd_pins axis_clock_converter_o2/s_axis_aresetn] [get_bd_pins axis_data_fifo_i0/s_axis_aresetn] \
  [get_bd_pins axis_data_fifo_i1/s_axis_aresetn] [get_bd_pins axis_data_fifo_i2/s_axis_aresetn] \
  [get_bd_pins axis_data_fifo_o0/s_axis_aresetn] [get_bd_pins axis_data_fifo_o1/s_axis_aresetn] \
  [get_bd_pins axis_data_fifo_o2/s_axis_aresetn] [get_bd_pins xadc/s_axi_aresetn]
connect_bd_net -net processing_system7_0_fclk_clk2 [get_bd_pins processing_system7/FCLK_CLK2] [get_bd_ports FCLK_CLK2]
connect_bd_net -net processing_system7_0_fclk_reset0_n [get_bd_pins processing_system7/FCLK_RESET0_N] [get_bd_ports FCLK_RESET0_N]
connect_bd_net -net processing_system7_0_fclk_reset1_n [get_bd_pins processing_system7/FCLK_RESET1_N] [get_bd_ports FCLK_RESET1_N]
connect_bd_net -net processing_system7_0_fclk_reset2_n [get_bd_pins processing_system7/FCLK_RESET2_N] [get_bd_ports FCLK_RESET2_N]
connect_bd_net -net processing_system7_0_fclk_reset3_n [get_bd_pins processing_system7/FCLK_RESET3_N] \
  [get_bd_ports FCLK_RESET3_N] [get_bd_pins proc_sys_reset/ext_reset_in]
connect_bd_net [get_bd_pins processing_system7/FCLK_CLK0] [get_bd_ports FCLK_CLK0]
connect_bd_net [get_bd_pins processing_system7/FCLK_CLK1] \
  [get_bd_ports FCLK_CLK1] [get_bd_pins axi_dma_0/m_axi_mm2s_aclk] [get_bd_pins axi_dma_0/m_axi_s2mm_aclk] \
  [get_bd_pins axi_dma_0/m_axi_sg_aclk] [get_bd_pins axi_dma_0/s_axi_lite_aclk] [get_bd_pins axi_dma_1/m_axi_mm2s_aclk] \
  [get_bd_pins axi_dma_1/m_axi_s2mm_aclk] [get_bd_pins axi_dma_1/m_axi_sg_aclk] [get_bd_pins axi_dma_1/s_axi_lite_aclk] \
  [get_bd_pins axi_dma_2/m_axi_mm2s_aclk] [get_bd_pins axi_dma_2/m_axi_s2mm_aclk] [get_bd_pins axi_dma_2/m_axi_sg_aclk] \
  [get_bd_pins axi_dma_2/s_axi_lite_aclk] [get_bd_pins axi_interconnect_dma_0/ACLK] \
  [get_bd_pins axi_interconnect_dma_0/M00_ACLK] [get_bd_pins axi_interconnect_dma_0/S00_ACLK] \
  [get_bd_pins axi_interconnect_dma_0/S01_ACLK] [get_bd_pins axi_interconnect_dma_1/ACLK] \
  [get_bd_pins axi_interconnect_dma_1/M00_ACLK] [get_bd_pins axi_interconnect_dma_1/S00_ACLK] \
  [get_bd_pins axi_interconnect_dma_1/S01_ACLK] [get_bd_pins axi_interconnect_dma_2/ACLK] \
  [get_bd_pins axi_interconnect_dma_2/M00_ACLK] [get_bd_pins axi_interconnect_dma_2/S00_ACLK] \
  [get_bd_pins axi_interconnect_dma_2/S01_ACLK] [get_bd_pins axi_interconnect_dma_ctl/ACLK] \
  [get_bd_pins axi_interconnect_dma_ctl/M00_ACLK] [get_bd_pins axi_interconnect_dma_ctl/S00_ACLK] \
  [get_bd_pins axi_interconnect_dma_ctl/S01_ACLK] [get_bd_pins axi_interconnect_dma_ctl/S02_ACLK] \
  [get_bd_pins axi_interconnect_gp1/ACLK] [get_bd_pins axi_interconnect_gp1/M00_ACLK] \
  [get_bd_pins axi_interconnect_gp1/M01_ACLK] [get_bd_pins axi_interconnect_gp1/M02_ACLK] \
  [get_bd_pins axi_interconnect_gp1/M03_ACLK] [get_bd_pins axi_interconnect_gp1/S00_ACLK] \
  [get_bd_pins axis_clock_converter_i0/m_axis_aclk] [get_bd_pins axis_clock_converter_i1/m_axis_aclk] \
  [get_bd_pins axis_clock_converter_i2/m_axis_aclk] [get_bd_pins axis_clock_converter_o0/s_axis_aclk] \
  [get_bd_pins axis_clock_converter_o1/s_axis_aclk] [get_bd_pins axis_clock_converter_o2/s_axis_aclk] \
  [get_bd_pins axis_data_fifo_i0/s_axis_aclk] [get_bd_pins axis_data_fifo_i1/s_axis_aclk] \
  [get_bd_pins axis_data_fifo_i2/s_axis_aclk] [get_bd_pins axis_data_fifo_o0/s_axis_aclk] \
  [get_bd_pins axis_data_fifo_o1/s_axis_aclk] [get_bd_pins axis_data_fifo_o2/s_axis_aclk] \
  [get_bd_pins proc_sys_reset/slowest_sync_clk] [get_bd_pins processing_system7/M_AXI_GP1_ACLK] \
  [get_bd_pins processing_system7/S_AXI_GP0_ACLK] [get_bd_pins processing_system7/S_AXI_HP0_ACLK] \
  [get_bd_pins processing_system7/S_AXI_HP1_ACLK] [get_bd_pins processing_system7/S_AXI_HP2_ACLK] \
  [get_bd_pins xadc/s_axi_aclk]
connect_bd_net [get_bd_pins processing_system7/FCLK_CLK3] [get_bd_ports FCLK_CLK3]
connect_bd_net [get_bd_pins processing_system7/GPIO_O] [get_bd_ports GPIO_O]
connect_bd_net [get_bd_pins processing_system7/GPIO_T] [get_bd_ports GPIO_T]
connect_bd_net [get_bd_pins processing_system7/SPI0_MISO_O] [get_bd_ports SPI0_MISO_O]
connect_bd_net [get_bd_pins processing_system7/SPI0_MISO_T] [get_bd_ports SPI0_MISO_T]
connect_bd_net [get_bd_pins processing_system7/SPI0_MOSI_O] [get_bd_ports SPI0_MOSI_O]
connect_bd_net [get_bd_pins processing_system7/SPI0_MOSI_T] [get_bd_ports SPI0_MOSI_T]
connect_bd_net [get_bd_pins processing_system7/SPI0_SCLK_O] [get_bd_ports SPI0_SCLK_O]
connect_bd_net [get_bd_pins processing_system7/SPI0_SCLK_T] [get_bd_ports SPI0_SCLK_T]
connect_bd_net [get_bd_pins processing_system7/SPI0_SS1_O] [get_bd_ports SPI0_SS1_O]
connect_bd_net [get_bd_pins processing_system7/SPI0_SS2_O] [get_bd_ports SPI0_SS2_O]
connect_bd_net [get_bd_pins processing_system7/SPI0_SS_O] [get_bd_ports SPI0_SS_O]
connect_bd_net [get_bd_pins processing_system7/SPI0_SS_T] [get_bd_ports SPI0_SS_T]
connect_bd_net [get_bd_pins xadc/ip2intc_irpt] [get_bd_pins xlconcat_0/In6]
connect_bd_net [get_bd_pins xlconcat_0/dout] [get_bd_pins processing_system7/IRQ_F2P]
connect_bd_net [get_bd_pins xlconstant/dout] [get_bd_pins proc_sys_reset/aux_reset_in]

# ---- address map ----
assign_bd_address -offset 0x00000000 -range 512M -target_address_space [get_bd_addr_spaces axi_dma_0/Data_MM2S] [get_bd_addr_segs processing_system7/S_AXI_HP0/HP0_DDR_LOWOCM]
assign_bd_address -offset 0x00000000 -range 512M -target_address_space [get_bd_addr_spaces axi_dma_0/Data_S2MM] [get_bd_addr_segs processing_system7/S_AXI_HP0/HP0_DDR_LOWOCM]
assign_bd_address -offset 0x00000000 -range 512M -target_address_space [get_bd_addr_spaces axi_dma_0/Data_SG] [get_bd_addr_segs processing_system7/S_AXI_GP0/GP0_DDR_LOWOCM]
exclude_bd_addr_seg -offset 0x40000000 -range 1G -target_address_space [get_bd_addr_spaces axi_dma_0/Data_SG] [get_bd_addr_segs processing_system7/S_AXI_GP0/GP0_M_AXI_GP0]
exclude_bd_addr_seg -offset 0x80000000 -range 1G -target_address_space [get_bd_addr_spaces axi_dma_0/Data_SG] [get_bd_addr_segs processing_system7/S_AXI_GP0/GP0_M_AXI_GP1]
exclude_bd_addr_seg -offset 0xE0000000 -range 4M -target_address_space [get_bd_addr_spaces axi_dma_0/Data_SG] [get_bd_addr_segs processing_system7/S_AXI_GP0/GP0_IOP]
exclude_bd_addr_seg -offset 0xFC000000 -range 16M -target_address_space [get_bd_addr_spaces axi_dma_0/Data_SG] [get_bd_addr_segs processing_system7/S_AXI_GP0/GP0_QSPI_LINEAR]
assign_bd_address -offset 0x00000000 -range 512M -target_address_space [get_bd_addr_spaces axi_dma_1/Data_MM2S] [get_bd_addr_segs processing_system7/S_AXI_HP1/HP1_DDR_LOWOCM]
assign_bd_address -offset 0x00000000 -range 512M -target_address_space [get_bd_addr_spaces axi_dma_1/Data_S2MM] [get_bd_addr_segs processing_system7/S_AXI_HP1/HP1_DDR_LOWOCM]
assign_bd_address -offset 0x00000000 -range 512M -target_address_space [get_bd_addr_spaces axi_dma_1/Data_SG] [get_bd_addr_segs processing_system7/S_AXI_GP0/GP0_DDR_LOWOCM]
exclude_bd_addr_seg -offset 0x40000000 -range 1G -target_address_space [get_bd_addr_spaces axi_dma_1/Data_SG] [get_bd_addr_segs processing_system7/S_AXI_GP0/GP0_M_AXI_GP0]
exclude_bd_addr_seg -offset 0x80000000 -range 1G -target_address_space [get_bd_addr_spaces axi_dma_1/Data_SG] [get_bd_addr_segs processing_system7/S_AXI_GP0/GP0_M_AXI_GP1]
exclude_bd_addr_seg -offset 0xE0000000 -range 4M -target_address_space [get_bd_addr_spaces axi_dma_1/Data_SG] [get_bd_addr_segs processing_system7/S_AXI_GP0/GP0_IOP]
exclude_bd_addr_seg -offset 0xFC000000 -range 16M -target_address_space [get_bd_addr_spaces axi_dma_1/Data_SG] [get_bd_addr_segs processing_system7/S_AXI_GP0/GP0_QSPI_LINEAR]
assign_bd_address -offset 0x00000000 -range 512M -target_address_space [get_bd_addr_spaces axi_dma_2/Data_MM2S] [get_bd_addr_segs processing_system7/S_AXI_HP2/HP2_DDR_LOWOCM]
assign_bd_address -offset 0x00000000 -range 512M -target_address_space [get_bd_addr_spaces axi_dma_2/Data_S2MM] [get_bd_addr_segs processing_system7/S_AXI_HP2/HP2_DDR_LOWOCM]
assign_bd_address -offset 0x00000000 -range 512M -target_address_space [get_bd_addr_spaces axi_dma_2/Data_SG] [get_bd_addr_segs processing_system7/S_AXI_GP0/GP0_DDR_LOWOCM]
exclude_bd_addr_seg -offset 0x40000000 -range 1G -target_address_space [get_bd_addr_spaces axi_dma_2/Data_SG] [get_bd_addr_segs processing_system7/S_AXI_GP0/GP0_M_AXI_GP0]
exclude_bd_addr_seg -offset 0x80000000 -range 1G -target_address_space [get_bd_addr_spaces axi_dma_2/Data_SG] [get_bd_addr_segs processing_system7/S_AXI_GP0/GP0_M_AXI_GP1]
exclude_bd_addr_seg -offset 0xE0000000 -range 4M -target_address_space [get_bd_addr_spaces axi_dma_2/Data_SG] [get_bd_addr_segs processing_system7/S_AXI_GP0/GP0_IOP]
exclude_bd_addr_seg -offset 0xFC000000 -range 16M -target_address_space [get_bd_addr_spaces axi_dma_2/Data_SG] [get_bd_addr_segs processing_system7/S_AXI_GP0/GP0_QSPI_LINEAR]
assign_bd_address -offset 0x40000000 -range 1G -target_address_space [get_bd_addr_spaces processing_system7/Data] [get_bd_addr_segs M_AXI_GP0/Reg]
assign_bd_address -offset 0x80400000 -range 64K -target_address_space [get_bd_addr_spaces processing_system7/Data] [get_bd_addr_segs axi_dma_0/S_AXI_LITE/Reg]
assign_bd_address -offset 0x80410000 -range 64K -target_address_space [get_bd_addr_spaces processing_system7/Data] [get_bd_addr_segs axi_dma_1/S_AXI_LITE/Reg]
assign_bd_address -offset 0x80420000 -range 64K -target_address_space [get_bd_addr_spaces processing_system7/Data] [get_bd_addr_segs axi_dma_2/S_AXI_LITE/Reg]
assign_bd_address -offset 0x83C00000 -range 64K -target_address_space [get_bd_addr_spaces processing_system7/Data] [get_bd_addr_segs xadc/s_axi_lite/Reg]

validate_bd_design
save_bd_design
